# EasyEDA Pro project Trabalho de Portas Lógicas_2025-01-02_21-14-25.eprj

# Schematic Schematic3
Board Name: Board3; Create Date: 2025-01-12; Page Name: P1; Project Name: Trabalho de Portas Lógicas_2025-01-02_21-14-25; Schematic Name: Schematic3; Update Date: 2025-01-12; Company: EasyEDA.com; Page Size: A4; Version: V1.0
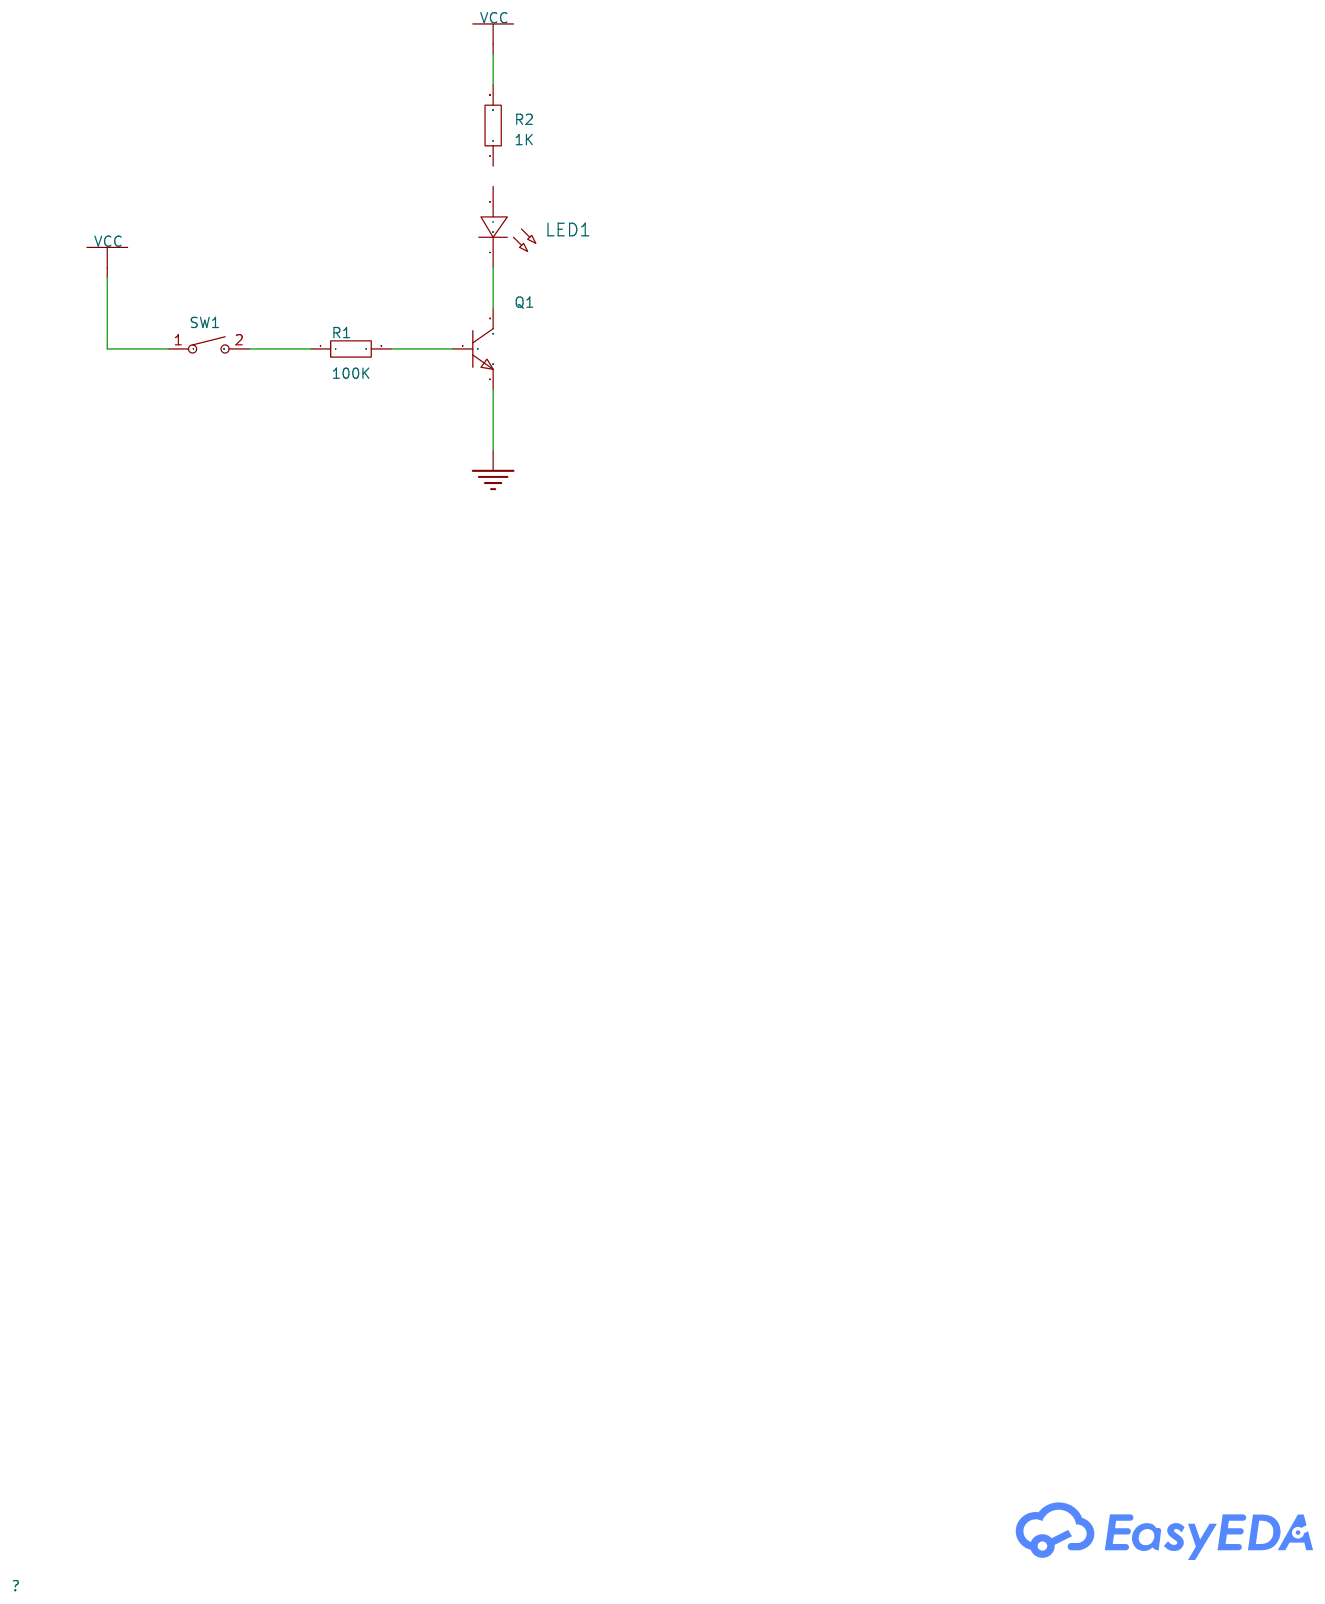
[diagram p0: schematic sheet]

## Parts
LED1  -  [LED_0603]
Q1  -  [S8050_SOT-23]
R1  100K  [R0603]
R2  1K  [R0603]
SW1  -  [SW-SMD_L4.0-W2.9-LS5.0]

## Library data of the parts
LED1 = LED_0603-R: Supplier Footprint: 0603
Q1 = S8050_SOT_NPN: Supplier Footprint: SOT-23
R1 R2 = Res_0603: Supplier Footprint: 0603
SW1 = TS-1185-C-A-B-A: Contact Current:50mA Voltage Rating (DC):12V Insulation Resistance:100mΩ Circuit:SPST Mounting Style:Brick nogging Actuator Style:Round Button Actuator/Cap Color:Black With Lamp:No Operating Force:260gf Mechanical Life:100000 Operating Temperature:-30℃~+85℃ Operating Temperature:-30℃~+85℃ Switch Length:4mm Switch Width:3mm Switch Height:2mm Strike Gundam:NO; LCSC Part Name: 3×4×22脚小龟 260gf; Supplier Part: C561519; Manufacturer: XKB Connectivity(中国星坤); Supplier Footprint: SMD; JLCPCB Part Class: Extended Part; Datasheet: https://atta.szlcsc.com/upload/public/pdf/source/20211011/C2F26DC0AE1820400F54DBF49644F5A1.pdf; Supplier: LCSC; Contact Current: 50mA; Voltage Rating (DC): 12V; Insulation Resistance: 100mΩ; Circuit: SPST; Mounting Style: Brick nogging; Actuator Style: Round Button; Actuator/Cap Color: Black; With Lamp: No; Operating Force: 260gf; Mechanical Life: 100000; Operating Temperature: -30℃~+85℃; Switch Length: 4mm; Switch Width: 3mm; Switch Height: 2mm; Strike Gundam: NO

## Nets
GND: Q1.2
VCC: R2.2 SW1.1
Net-(LED1-1): LED1.1(C) Q1.3
Net-(Q1-1): Q1.1 R1.2
Net-(R1-1): R1.1 SW1.2

Not connected (* = marked no-connect by the designer): LED1 2(A); R2 1

# Schematic Schematic4
Board Name: Board4; Create Date: 2025-01-12; Page Name: P1; Project Name: Trabalho de Portas Lógicas_2025-01-02_21-14-25; Schematic Name: Schematic4; Update Date: 2025-01-12; Company: EasyEDA.com; Page Size: A4; Version: V1.0
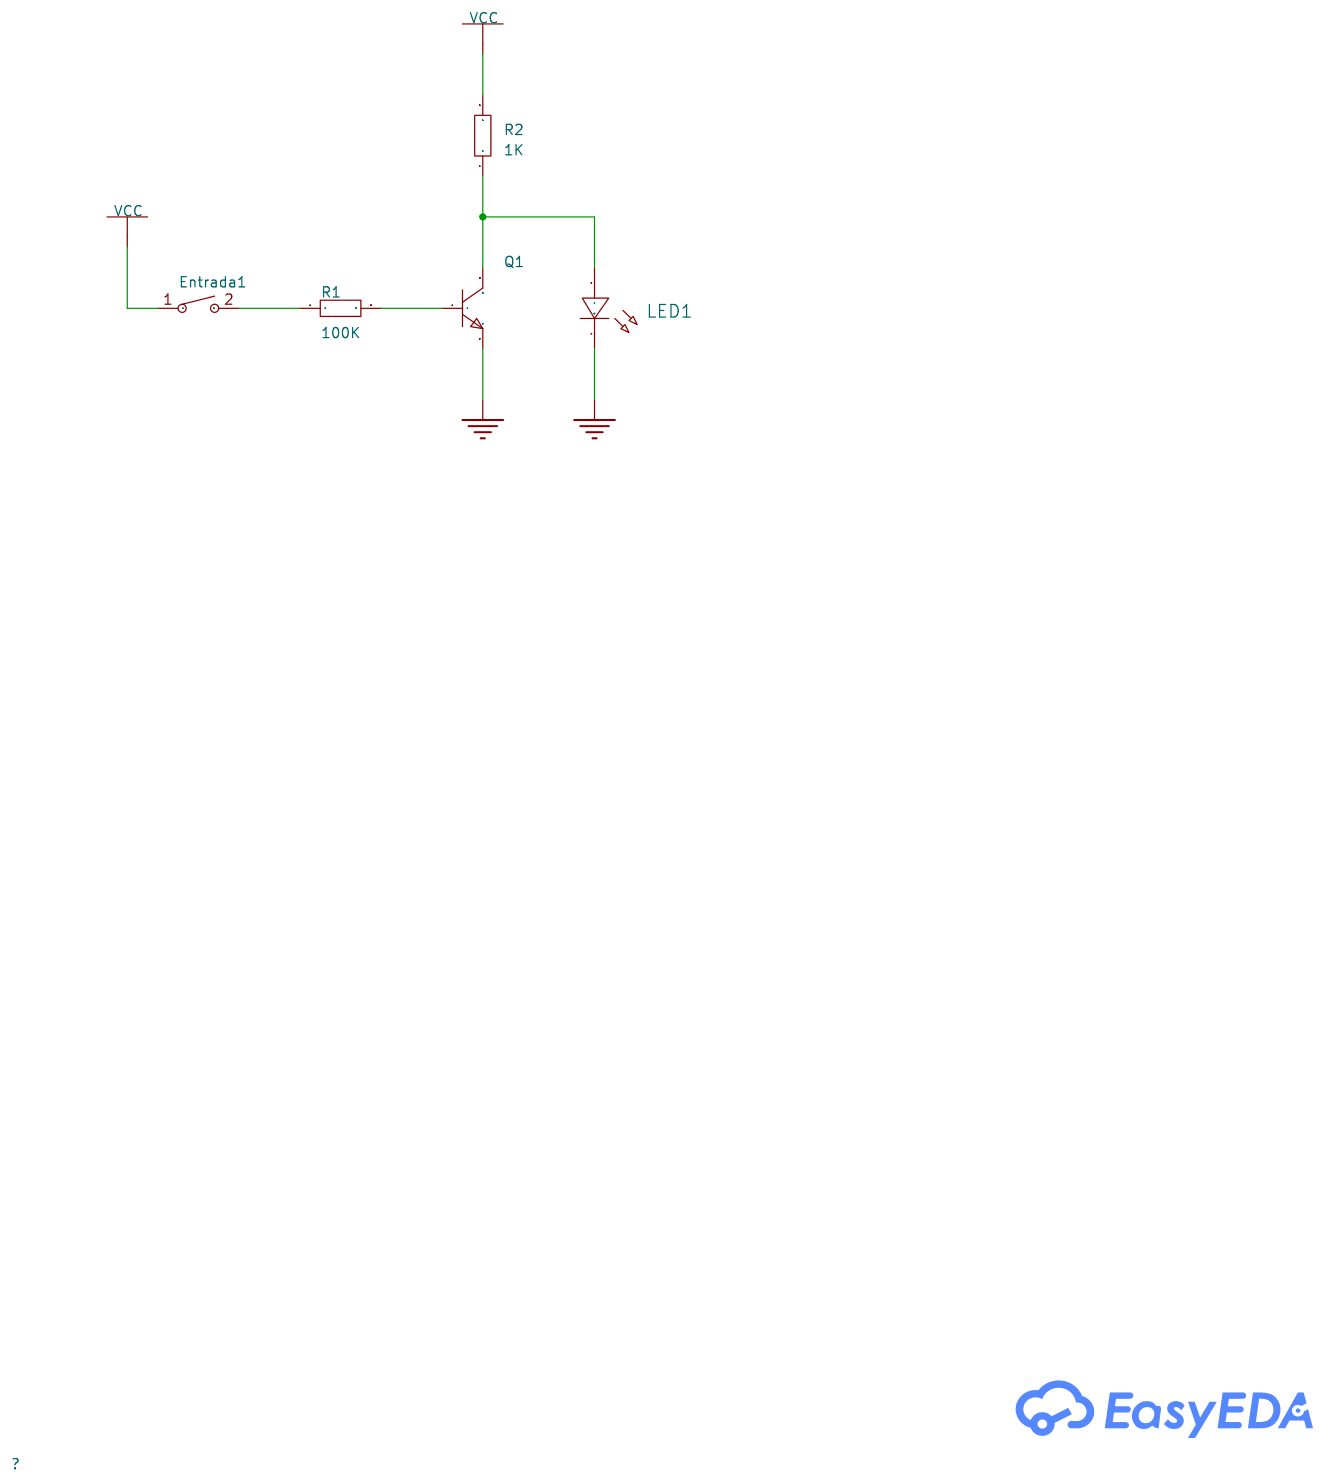
[diagram p1: schematic sheet]

## Parts
Entrada1  -  [SW-SMD_L4.0-W2.9-LS5.0]
LED1  -  [LED_0603]
Q1  -  [S8050_SOT-23]
R1  100K  [R0603]
R2  1K  [R0603]

## Library data of the parts
Entrada1 = TS-1185-C-A-B-A: Contact Current:50mA Voltage Rating (DC):12V Insulation Resistance:100mΩ Circuit:SPST Mounting Style:Brick nogging Actuator Style:Round Button Actuator/Cap Color:Black With Lamp:No Operating Force:260gf Mechanical Life:100000 Operating Temperature:-30℃~+85℃ Operating Temperature:-30℃~+85℃ Switch Length:4mm Switch Width:3mm Switch Height:2mm Strike Gundam:NO; LCSC Part Name: 3×4×22脚小龟 260gf; Supplier Part: C561519; Manufacturer: XKB Connectivity(中国星坤); Supplier Footprint: SMD; JLCPCB Part Class: Extended Part; Datasheet: https://atta.szlcsc.com/upload/public/pdf/source/20211011/C2F26DC0AE1820400F54DBF49644F5A1.pdf; Supplier: LCSC; Contact Current: 50mA; Voltage Rating (DC): 12V; Insulation Resistance: 100mΩ; Circuit: SPST; Mounting Style: Brick nogging; Actuator Style: Round Button; Actuator/Cap Color: Black; With Lamp: No; Operating Force: 260gf; Mechanical Life: 100000; Operating Temperature: -30℃~+85℃; Switch Length: 4mm; Switch Width: 3mm; Switch Height: 2mm; Strike Gundam: NO
LED1 = LED_0603-R: Supplier Footprint: 0603
Q1 = S8050_SOT_NPN: Supplier Footprint: SOT-23
R1 R2 = Res_0603: Supplier Footprint: 0603

## Nets
GND: LED1.1(C) Q1.2
VCC: Entrada1.1 R2.2
Net-(Entrada1-2): Entrada1.2 R1.1
Net-(LED1-2): LED1.2(A) Q1.3 R2.1
Net-(Q1-1): Q1.1 R1.2

# Schematic Schematic5
Board Name: Board5; Create Date: 2025-01-12; Page Name: P1; Project Name: Trabalho de Portas Lógicas_2025-01-02_21-14-25; Schematic Name: Schematic5; Update Date: 2025-01-12; Company: EasyEDA.com; Page Size: A4; Version: V1.0
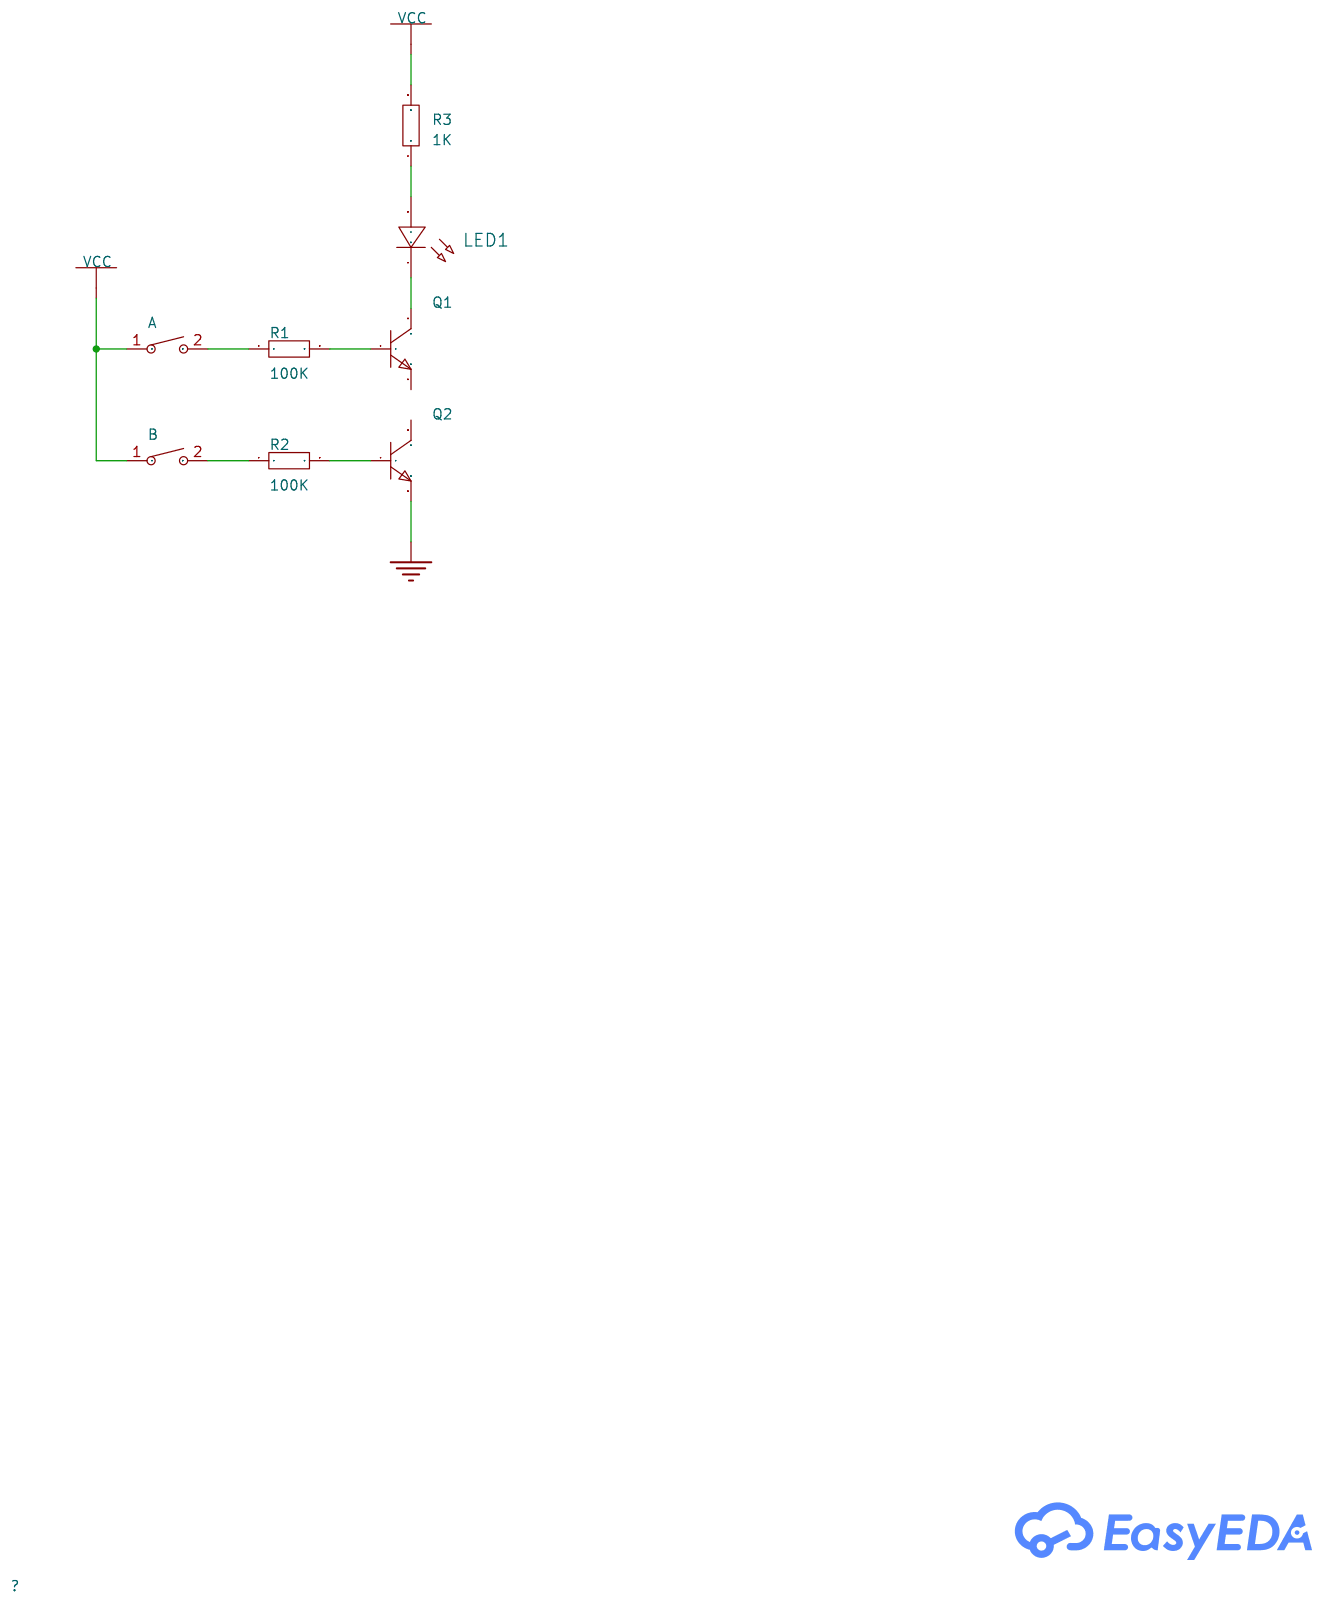
[diagram p2: schematic sheet]

## Parts
A  -  [SW-SMD_L4.0-W2.9-LS5.0]
B  -  [SW-SMD_L4.0-W2.9-LS5.0]
LED1  -  [LED_0603]
Q1  -  [S8050_SOT-23]
Q2  -  [S8050_SOT-23]
R1  100K  [R0603]
R2  100K  [R0603]
R3  1K  [R0603]

## Library data of the parts
A B = TS-1185-C-A-B-A: Contact Current:50mA Voltage Rating (DC):12V Insulation Resistance:100mΩ Circuit:SPST Mounting Style:Brick nogging Actuator Style:Round Button Actuator/Cap Color:Black With Lamp:No Operating Force:260gf Mechanical Life:100000 Operating Temperature:-30℃~+85℃ Operating Temperature:-30℃~+85℃ Switch Length:4mm Switch Width:3mm Switch Height:2mm Strike Gundam:NO; LCSC Part Name: 3×4×22脚小龟 260gf; Supplier Part: C561519; Manufacturer: XKB Connectivity(中国星坤); Supplier Footprint: SMD; JLCPCB Part Class: Extended Part; Datasheet: https://atta.szlcsc.com/upload/public/pdf/source/20211011/C2F26DC0AE1820400F54DBF49644F5A1.pdf; Supplier: LCSC; Contact Current: 50mA; Voltage Rating (DC): 12V; Insulation Resistance: 100mΩ; Circuit: SPST; Mounting Style: Brick nogging; Actuator Style: Round Button; Actuator/Cap Color: Black; With Lamp: No; Operating Force: 260gf; Mechanical Life: 100000; Operating Temperature: -30℃~+85℃; Switch Length: 4mm; Switch Width: 3mm; Switch Height: 2mm; Strike Gundam: NO
LED1 = LED_0603-R: Supplier Footprint: 0603
Q1 Q2 = S8050_SOT_NPN: Supplier Footprint: SOT-23
R1-R3 = Res_0603: Supplier Footprint: 0603

## Nets
GND: Q2.2
VCC: A.1 B.1 R3.2
Net-(A-2): A.2 R1.1
Net-(B-2): B.2 R2.1
Net-(LED1-1): LED1.1(C) Q1.3
Net-(LED1-2): LED1.2(A) R3.1
Net-(Q1-1): Q1.1 R1.2
Net-(Q2-1): Q2.1 R2.2

Not connected (* = marked no-connect by the designer): Q1 2; Q2 3

# Schematic Schematic6
Board Name: Board6; Create Date: 2025-01-12; Page Name: P1; Project Name: Trabalho de Portas Lógicas_2025-01-02_21-14-25; Schematic Name: Schematic6; Update Date: 2025-01-12; Company: EasyEDA.com; Page Size: A4; Version: V1.0
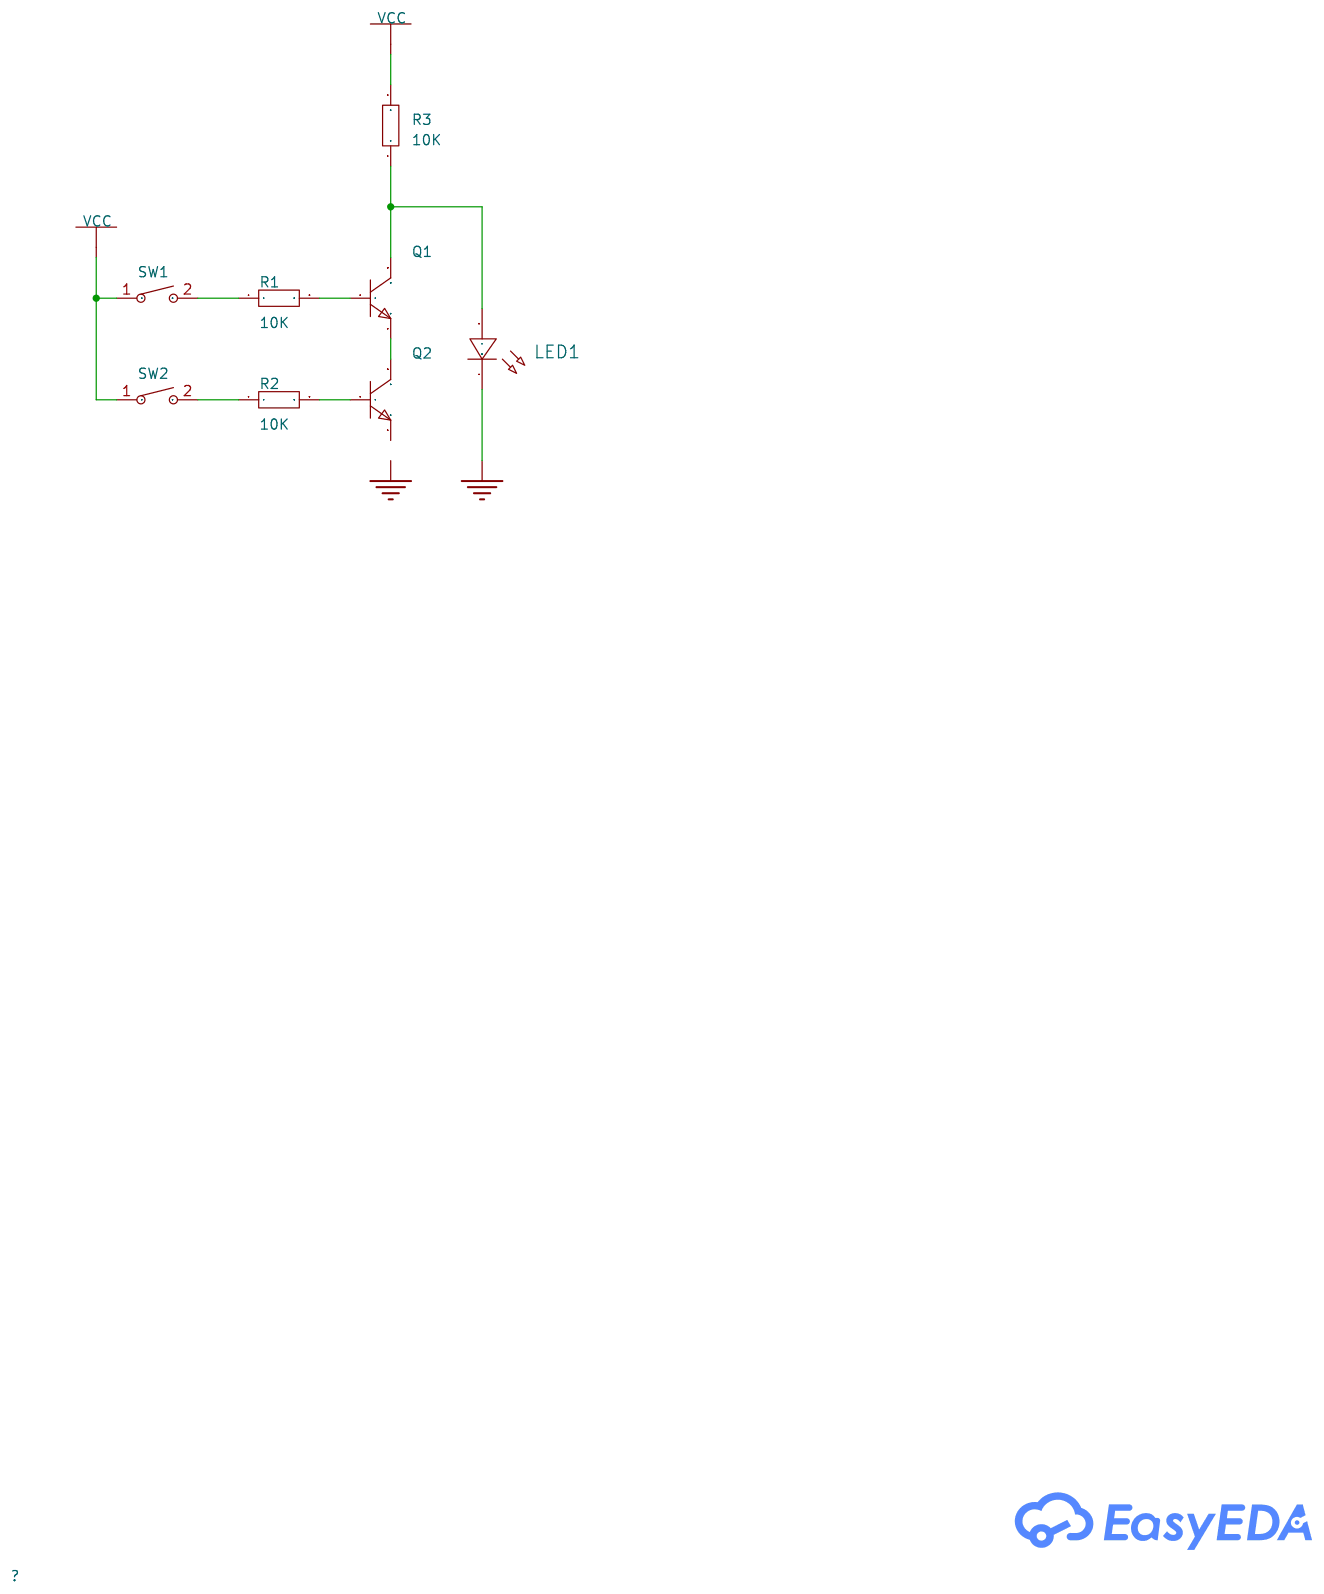
[diagram p3: schematic sheet]

## Parts
LED1  -  [LED_0603]
Q1  -  [S8050_SOT-23]
Q2  -  [S8050_SOT-23]
R1  10K  [R0603]
R2  10K  [R0603]
R3  10K  [R0603]
SW1  -  [SW-SMD_L4.0-W2.9-LS5.0]
SW2  -  [SW-SMD_L4.0-W2.9-LS5.0]

## Library data of the parts
LED1 = LED_0603-R: Supplier Footprint: 0603
Q1 Q2 = S8050_SOT_NPN: Supplier Footprint: SOT-23
R1-R3 = Res_0603: Supplier Footprint: 0603
SW1 SW2 = TS-1185-C-A-B-A: Contact Current:50mA Voltage Rating (DC):12V Insulation Resistance:100mΩ Circuit:SPST Mounting Style:Brick nogging Actuator Style:Round Button Actuator/Cap Color:Black With Lamp:No Operating Force:260gf Mechanical Life:100000 Operating Temperature:-30℃~+85℃ Operating Temperature:-30℃~+85℃ Switch Length:4mm Switch Width:3mm Switch Height:2mm Strike Gundam:NO; LCSC Part Name: 3×4×22脚小龟 260gf; Supplier Part: C561519; Manufacturer: XKB Connectivity(中国星坤); Supplier Footprint: SMD; JLCPCB Part Class: Extended Part; Datasheet: https://atta.szlcsc.com/upload/public/pdf/source/20211011/C2F26DC0AE1820400F54DBF49644F5A1.pdf; Supplier: LCSC; Contact Current: 50mA; Voltage Rating (DC): 12V; Insulation Resistance: 100mΩ; Circuit: SPST; Mounting Style: Brick nogging; Actuator Style: Round Button; Actuator/Cap Color: Black; With Lamp: No; Operating Force: 260gf; Mechanical Life: 100000; Operating Temperature: -30℃~+85℃; Switch Length: 4mm; Switch Width: 3mm; Switch Height: 2mm; Strike Gundam: NO

## Nets
GND: LED1.1(C)
VCC: R3.2 SW1.1 SW2.1
Net-(LED1-2): LED1.2(A) Q1.3 R3.1
Net-(Q1-1): Q1.1 R1.2
Net-(Q1-2): Q1.2 Q2.3
Net-(Q2-1): Q2.1 R2.2
Net-(R1-1): R1.1 SW1.2
Net-(R2-1): R2.1 SW2.2

Not connected (* = marked no-connect by the designer): Q2 2

# Schematic Schematic7
Board Name: Board7; Create Date: 2025-01-12; Page Name: P1; Project Name: Trabalho de Portas Lógicas_2025-01-02_21-14-25; Schematic Name: Schematic7; Update Date: 2025-01-12; Company: EasyEDA.com; Page Size: A4; Version: V1.0
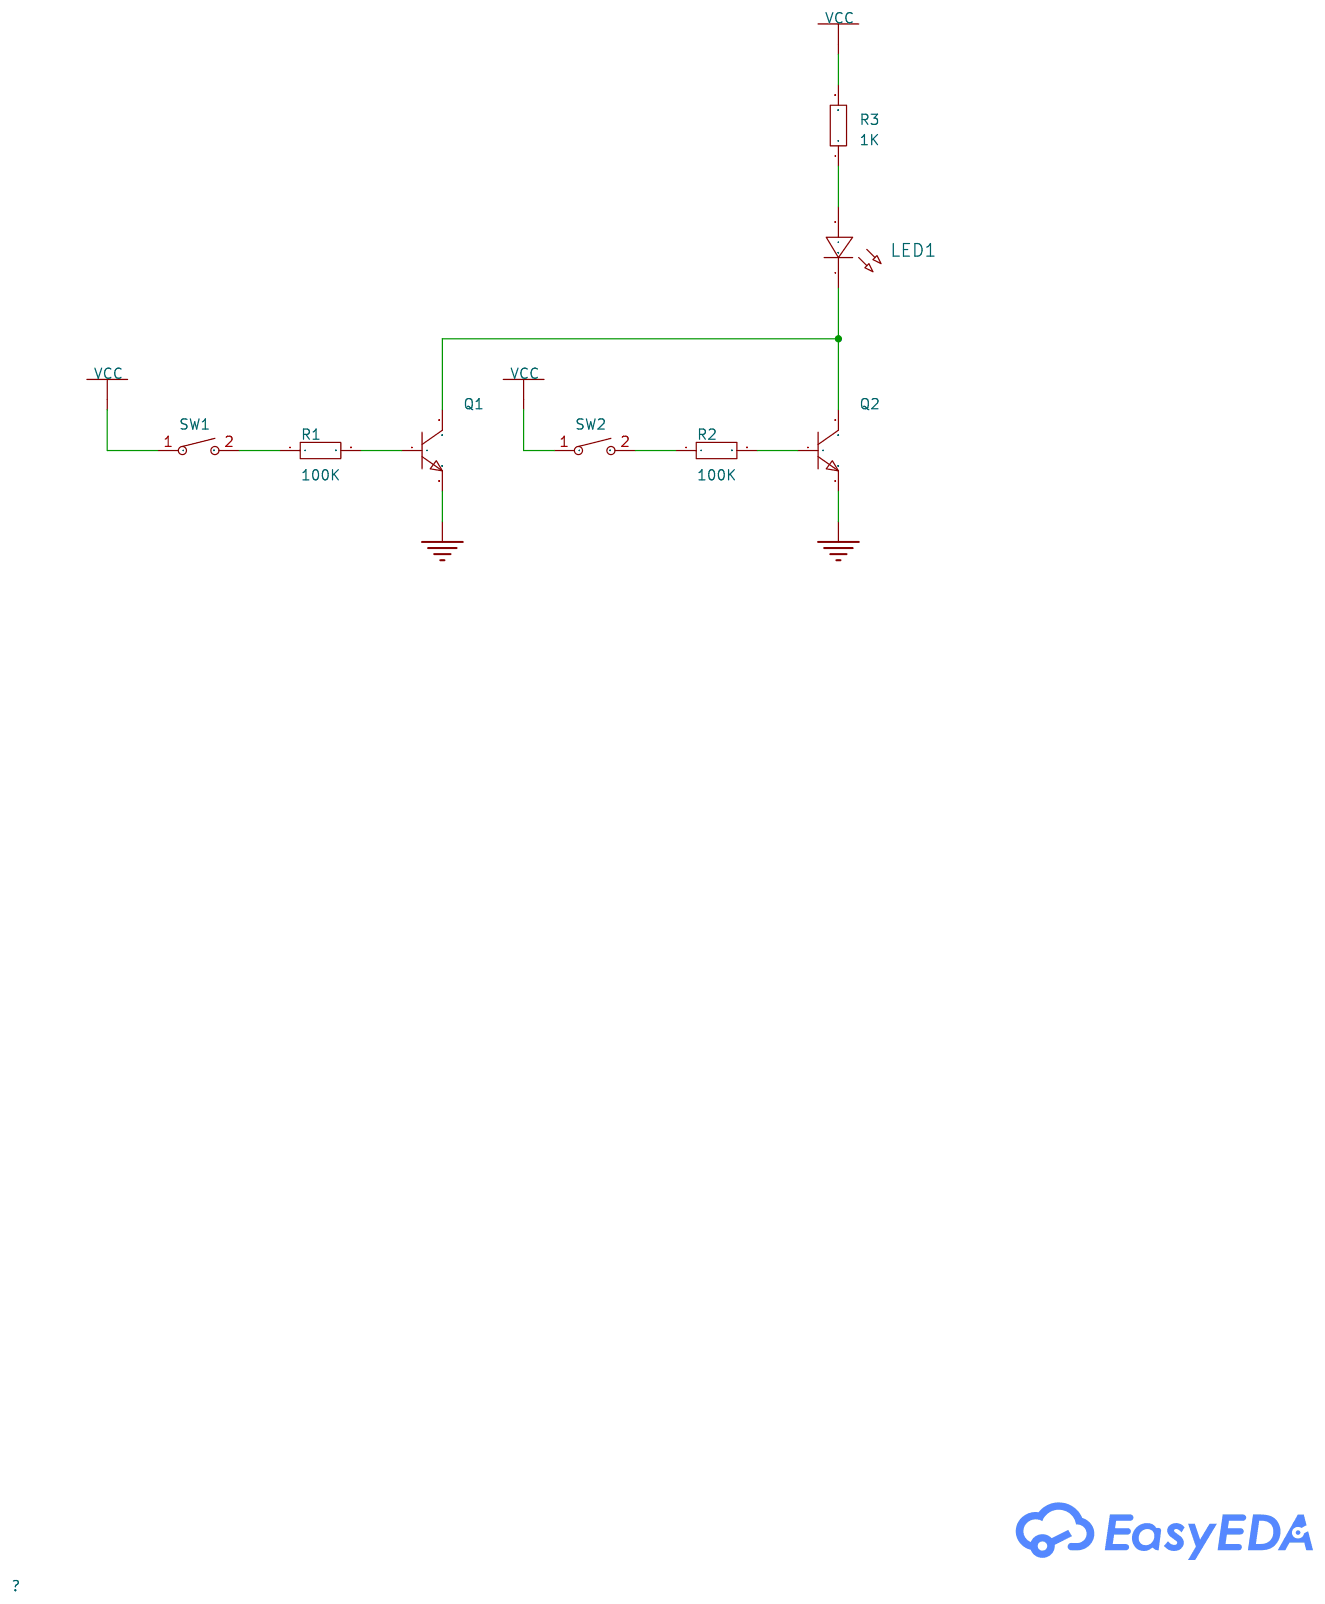
[diagram p4: schematic sheet]

## Parts
LED1  -  [LED_0603]
Q1  -  [S8050_SOT-23]
Q2  -  [S8050_SOT-23]
R1  100K  [R0603]
R2  100K  [R0603]
R3  1K  [R0603]
SW1  -  [SW-SMD_L4.0-W2.9-LS5.0]
SW2  -  [SW-SMD_L4.0-W2.9-LS5.0]

## Library data of the parts
LED1 = LED_0603-R: Supplier Footprint: 0603
Q1 Q2 = S8050_SOT_NPN: Supplier Footprint: SOT-23
R1-R3 = Res_0603: Supplier Footprint: 0603
SW1 SW2 = TS-1185-C-A-B-A: Contact Current:50mA Voltage Rating (DC):12V Insulation Resistance:100mΩ Circuit:SPST Mounting Style:Brick nogging Actuator Style:Round Button Actuator/Cap Color:Black With Lamp:No Operating Force:260gf Mechanical Life:100000 Operating Temperature:-30℃~+85℃ Operating Temperature:-30℃~+85℃ Switch Length:4mm Switch Width:3mm Switch Height:2mm Strike Gundam:NO; LCSC Part Name: 3×4×22脚小龟 260gf; Supplier Part: C561519; Manufacturer: XKB Connectivity(中国星坤); Supplier Footprint: SMD; JLCPCB Part Class: Extended Part; Datasheet: https://atta.szlcsc.com/upload/public/pdf/source/20211011/C2F26DC0AE1820400F54DBF49644F5A1.pdf; Supplier: LCSC; Contact Current: 50mA; Voltage Rating (DC): 12V; Insulation Resistance: 100mΩ; Circuit: SPST; Mounting Style: Brick nogging; Actuator Style: Round Button; Actuator/Cap Color: Black; With Lamp: No; Operating Force: 260gf; Mechanical Life: 100000; Operating Temperature: -30℃~+85℃; Switch Length: 4mm; Switch Width: 3mm; Switch Height: 2mm; Strike Gundam: NO

## Nets
GND: Q1.2 Q2.2
VCC: R3.2 SW1.1 SW2.1
Net-(LED1-1): LED1.1(C) Q1.3 Q2.3
Net-(LED1-2): LED1.2(A) R3.1
Net-(Q1-1): Q1.1 R1.2
Net-(Q2-1): Q2.1 R2.2
Net-(R1-1): R1.1 SW1.2
Net-(R2-1): R2.1 SW2.2

# Schematic Schematic8
Board Name: Board8; Create Date: 2025-01-12; Page Name: P1; Project Name: Trabalho de Portas Lógicas_2025-01-02_21-14-25; Schematic Name: Schematic8; Update Date: 2025-01-12; Company: EasyEDA.com; Page Size: A4; Version: V1.0
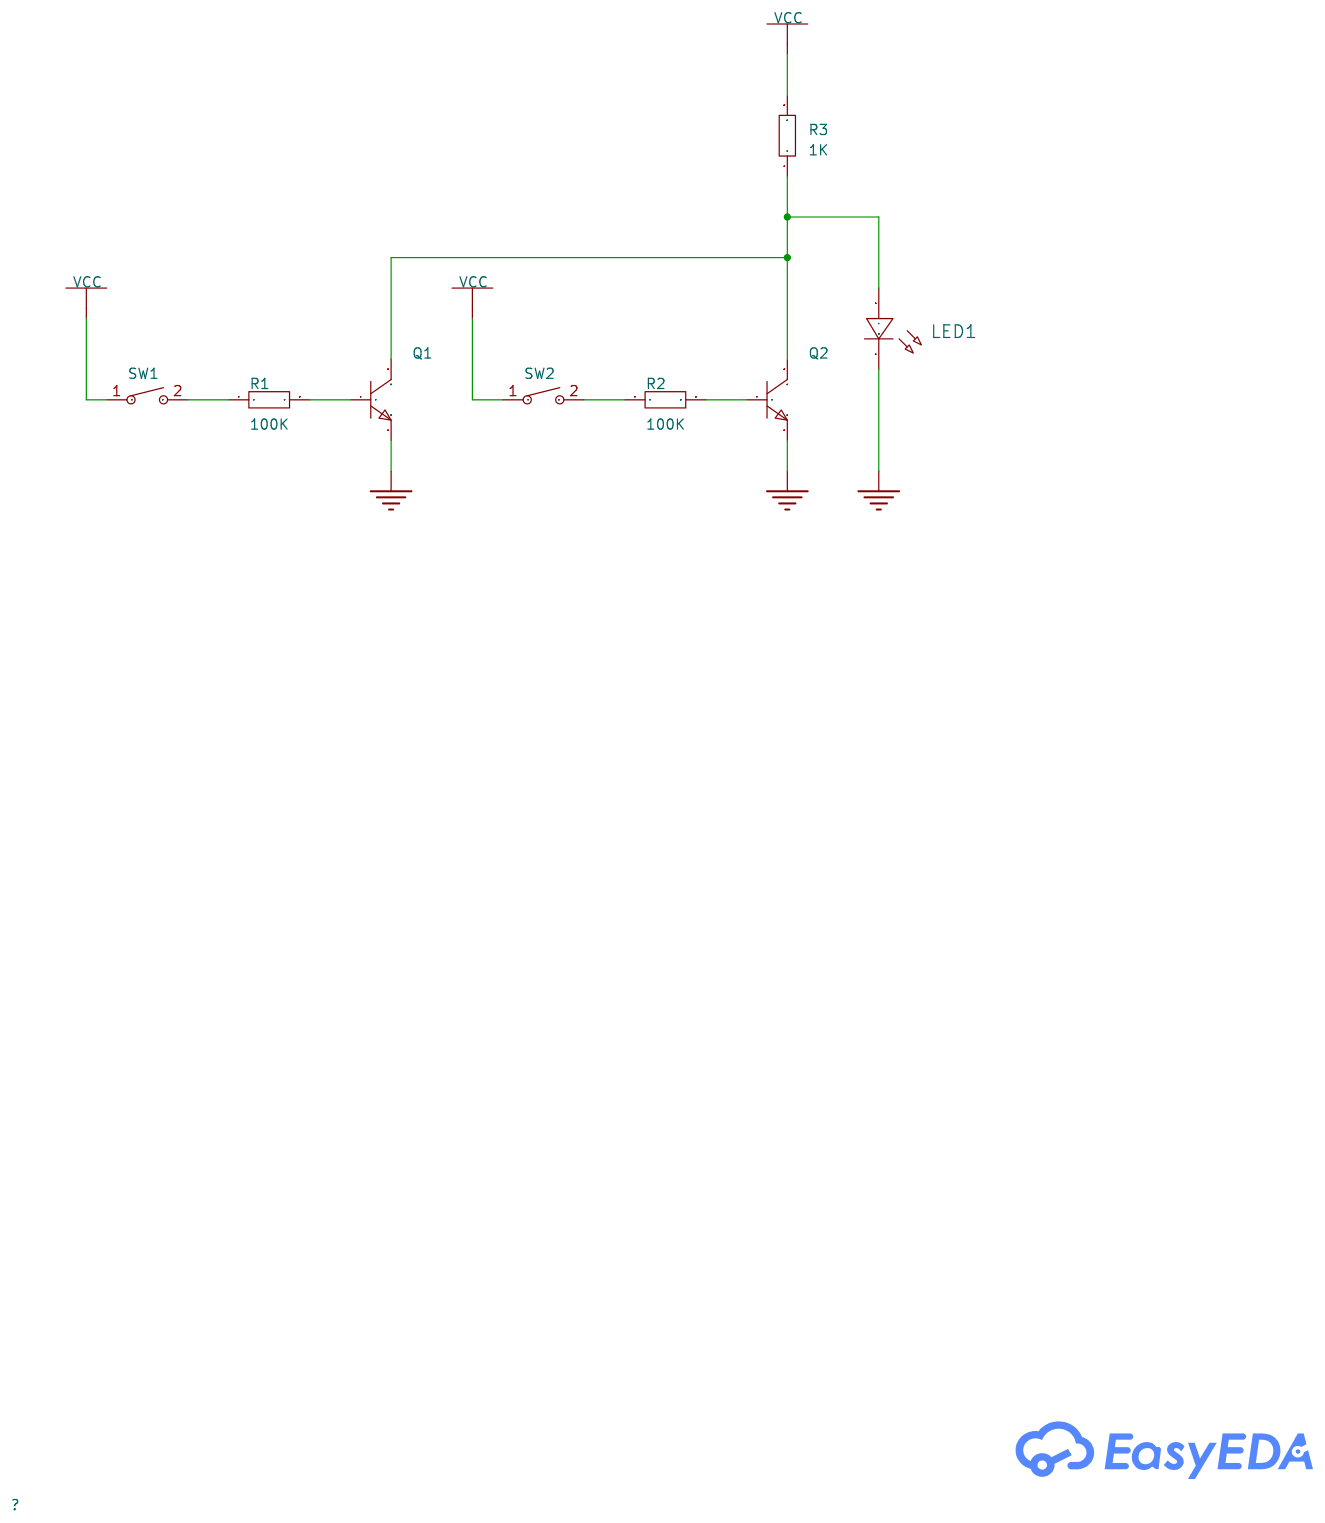
[diagram p5: schematic sheet]

## Parts
LED1  -  [LED_0603]
Q1  -  [S8050_SOT-23]
Q2  -  [S8050_SOT-23]
R1  100K  [R0603]
R2  100K  [R0603]
R3  1K  [R0603]
SW1  -  [SW-SMD_L4.0-W2.9-LS5.0]
SW2  -  [SW-SMD_L4.0-W2.9-LS5.0]

## Library data of the parts
LED1 = LED_0603-R: Supplier Footprint: 0603
Q1 Q2 = S8050_SOT_NPN: Supplier Footprint: SOT-23
R1-R3 = Res_0603: Supplier Footprint: 0603
SW1 SW2 = TS-1185-C-A-B-A: Contact Current:50mA Voltage Rating (DC):12V Insulation Resistance:100mΩ Circuit:SPST Mounting Style:Brick nogging Actuator Style:Round Button Actuator/Cap Color:Black With Lamp:No Operating Force:260gf Mechanical Life:100000 Operating Temperature:-30℃~+85℃ Operating Temperature:-30℃~+85℃ Switch Length:4mm Switch Width:3mm Switch Height:2mm Strike Gundam:NO; LCSC Part Name: 3×4×22脚小龟 260gf; Supplier Part: C561519; Manufacturer: XKB Connectivity(中国星坤); Supplier Footprint: SMD; JLCPCB Part Class: Extended Part; Datasheet: https://atta.szlcsc.com/upload/public/pdf/source/20211011/C2F26DC0AE1820400F54DBF49644F5A1.pdf; Supplier: LCSC; Contact Current: 50mA; Voltage Rating (DC): 12V; Insulation Resistance: 100mΩ; Circuit: SPST; Mounting Style: Brick nogging; Actuator Style: Round Button; Actuator/Cap Color: Black; With Lamp: No; Operating Force: 260gf; Mechanical Life: 100000; Operating Temperature: -30℃~+85℃; Switch Length: 4mm; Switch Width: 3mm; Switch Height: 2mm; Strike Gundam: NO

## Nets
GND: LED1.1(C) Q1.2 Q2.2
VCC: R3.2 SW1.1 SW2.1
Net-(LED1-2): LED1.2(A) Q1.3 Q2.3 R3.1
Net-(Q1-1): Q1.1 R1.2
Net-(Q2-1): Q2.1 R2.2
Net-(R1-1): R1.1 SW1.2
Net-(R2-1): R2.1 SW2.2
